# EAGLE design EpyxFastLoad (EAGLE 9.5.2)
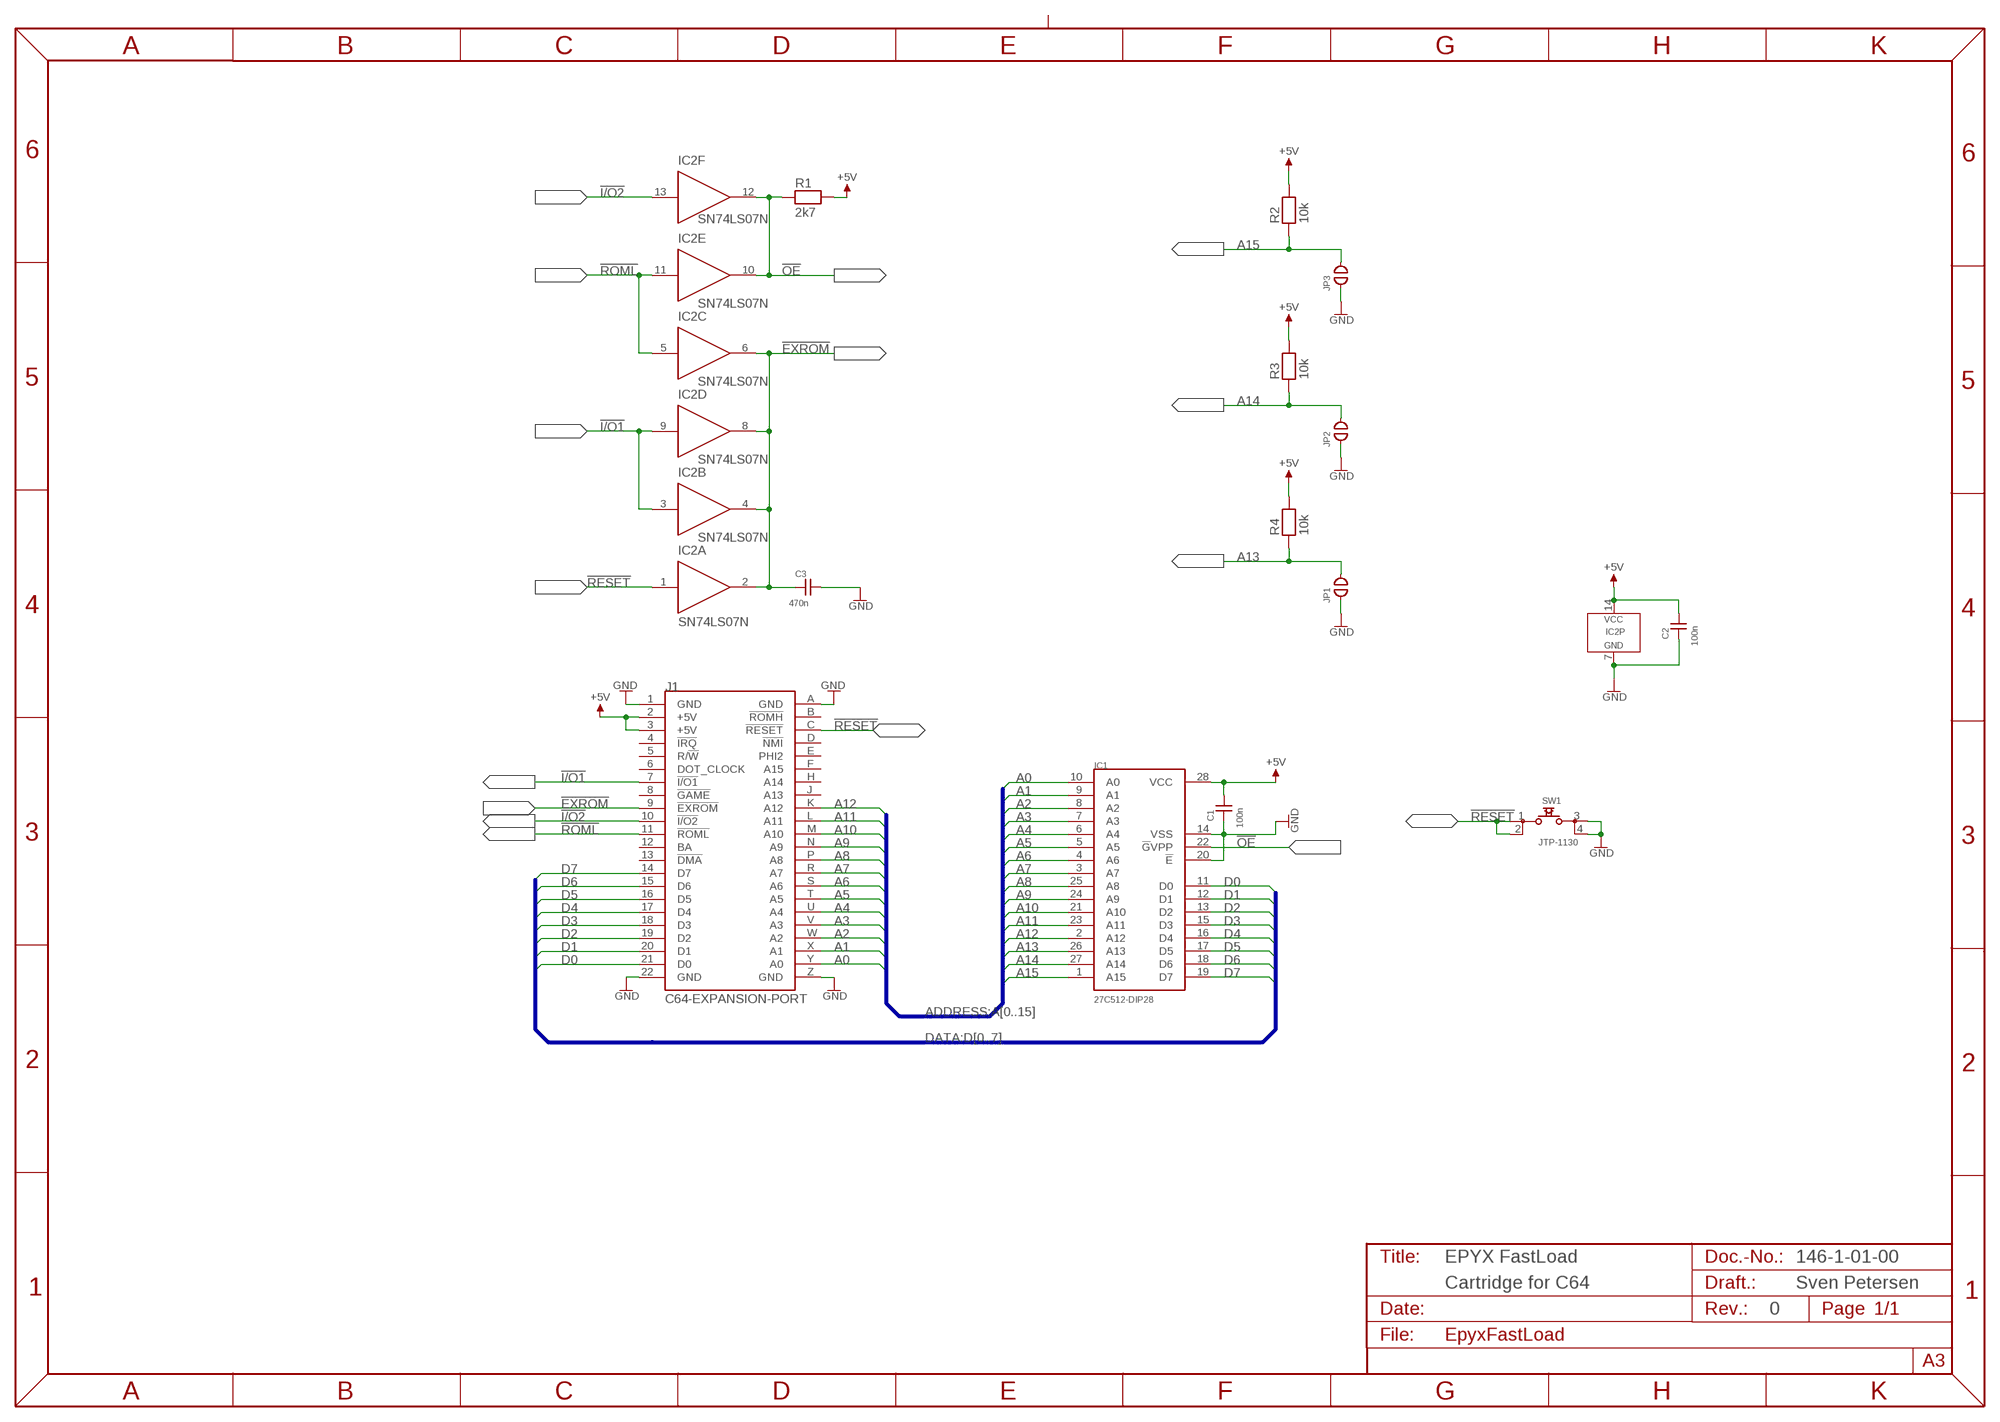
[diagram p0: schematic, sheet 1]

## Parts
C1  100n  CAP01  [C-2,5]
C2  100n  CAP01  [C-2,5]
C3  470n  CAP02  [C-5]
IC1  27C512-DIP28  M27C512-DIP28  [DIL28-6]
IC2  SN74LS07N  7407N  [DIL-14]
J1  C64-EXPANSION-PORT  C64-EXPANSIONPNARROW  [EXPANSIO_SQ]
JP1  OPEN  [CP_OP]
JP2  OPEN  [CP_OP]
JP3  OPEN  [CP_OP]
R1  2k7  RES04  [R-10]
R2  10k  RES04  [R-10]
R3  10k  RES04  [R-10]
R4  10k  RES04  [R-10]
SW1  JTP-1130  [JTP-1130]

## Nets
!EXROM: C3.1 IC2.2(A:O) IC2.4(B:O) IC2.6(C:O) IC2.8(D:O) J1.9(!EXROM)
!I/O1: IC2.3(B:I) IC2.9(D:I) J1.7(!I/O1)
!I/O2: IC2.13(F:I) J1.10(!I/O2)
!OE: IC1.22(!G!VPP) IC2.10(E:O) IC2.12(F:O) R1.1
!RESET: IC2.1(A:I) J1.C(!RESET) SW1.1 SW1.2
!ROML: IC2.5(C:I) IC2.11(E:I) J1.11(!ROML)
+5V: C1.2 C2.2 IC1.28(VCC) IC2.14(P:VCC) J1.2(+5V) J1.3(+5V) R1.2 R2.2 R3.2 R4.2
A0: IC1.10(A0) J1.Y(A0)
A1: IC1.9(A1) J1.X(A1)
A2: IC1.8(A2) J1.W(A2)
A3: IC1.7(A3) J1.V(A3)
A4: IC1.6(A4) J1.U(A4)
A5: IC1.5(A5) J1.T(A5)
A6: IC1.4(A6) J1.S(A6)
A7: IC1.3(A7) J1.R(A7)
A8: IC1.25(A8) J1.P(A8)
A9: IC1.24(A9) J1.N(A9)
A10: IC1.21(A10) J1.M(A10)
A11: IC1.23(A11) J1.L(A11)
A12: IC1.2(A12) J1.K(A12)
A13: IC1.26(A13) JP1.2 R4.1
A14: IC1.27(A14) JP2.2 R3.1
A15: IC1.1(A15) JP3.2 R2.1
D0: IC1.11(D0) J1.21(D0)
D1: IC1.12(D1) J1.20(D1)
D2: IC1.13(D2) J1.19(D2)
D3: IC1.15(D3) J1.18(D3)
D4: IC1.16(D4) J1.17(D4)
D5: IC1.17(D5) J1.16(D5)
D6: IC1.18(D6) J1.15(D6)
D7: IC1.19(D7) J1.14(D7)
GND: C1.1 C2.1 C3.2 IC1.14(VSS) IC1.20(!E) IC2.7(P:GND) J1.1(GND) J1.22(GND) J1.A(GND) J1.Z(GND) JP1.1 JP2.1 JP3.1 SW1.3 SW1.4
Unconnected: J1.4(!IRQ) J1.5(R/!W) J1.6(DOT_CLOCK) J1.8(!GAME) J1.12(BA) J1.13(!DMA) J1.B(!ROMH) J1.D(!NMI) J1.E(PHI2) J1.F(A15) J1.H(A14) J1.J(A13)

## Buses
DATA:D[0..7]
ADDRESS:A[0..15]

## Notes on the sheet
- EPYX FastLoad | 146-1-01-00
- Cartridge for C64 | Sven Petersen
- 0

## Library data of the parts
C1 C2 = DISCRETE:CAP01
C3 = DISCRETE:CAP02
IC1 = ST:M27C512
IC2 = 74XX:7407
J1 = Commodore:C64-EXPANSIONP
JP1-JP3 = Cutpad:OPEN: open Cutpad
R1-R4 = DISCRETE:RES04
SW1 = Namae_Electronics:JTP-1130

## Board
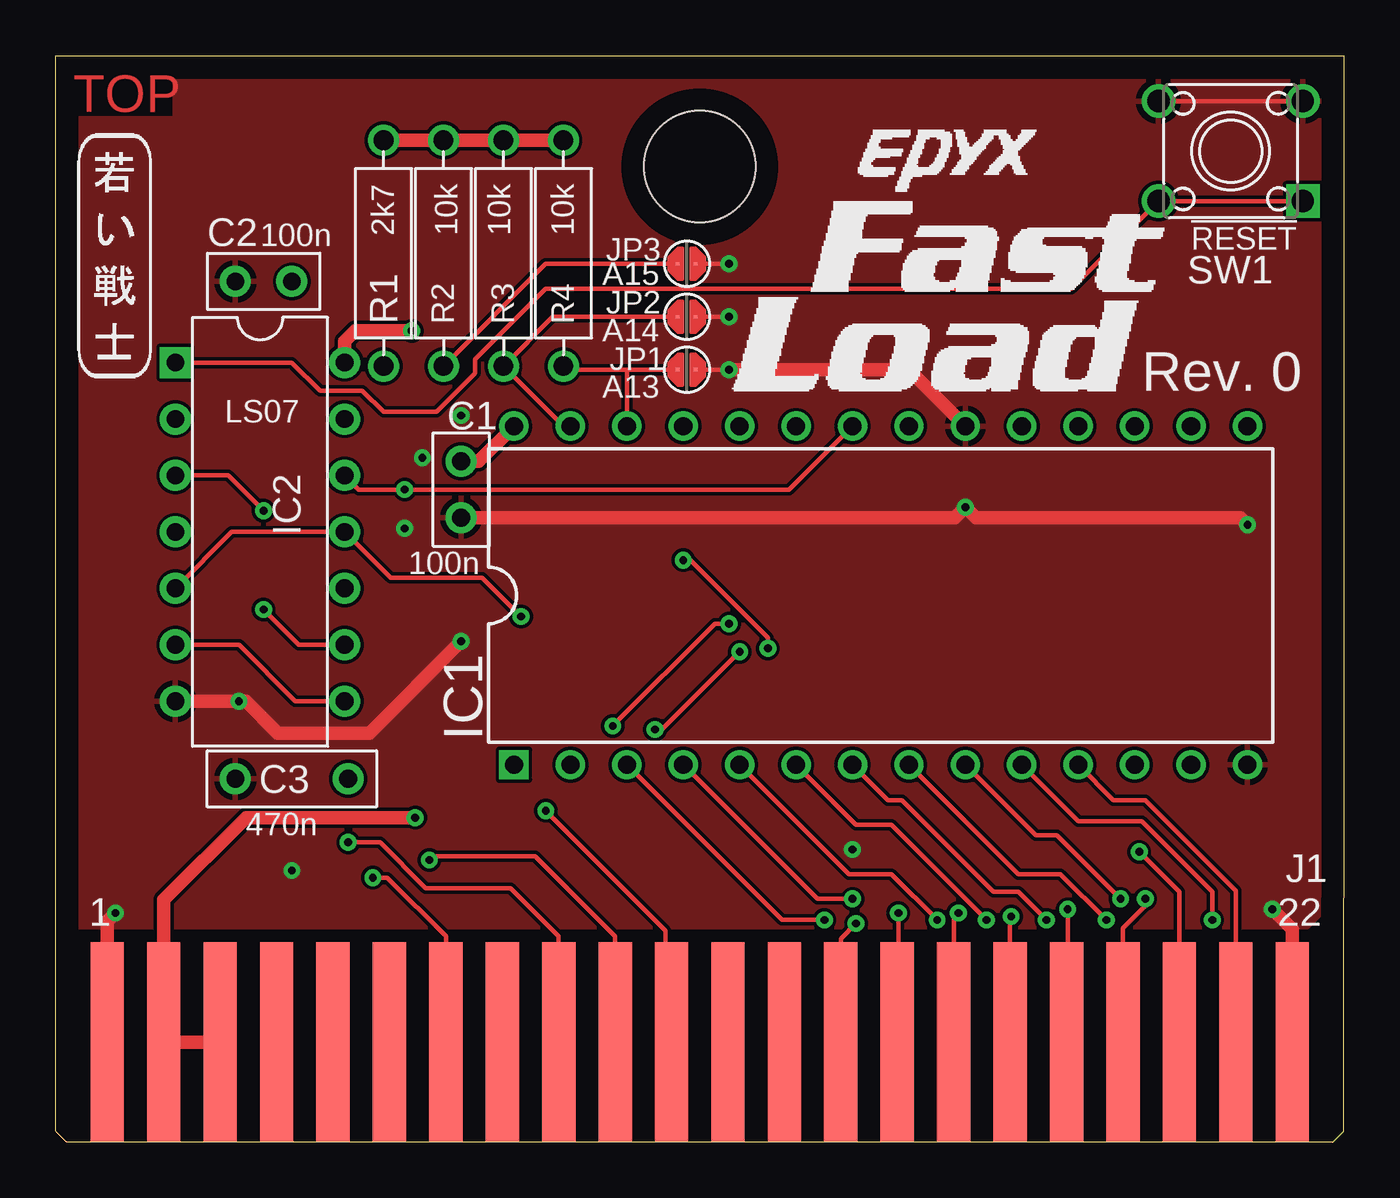
[diagram p1: board, top side]
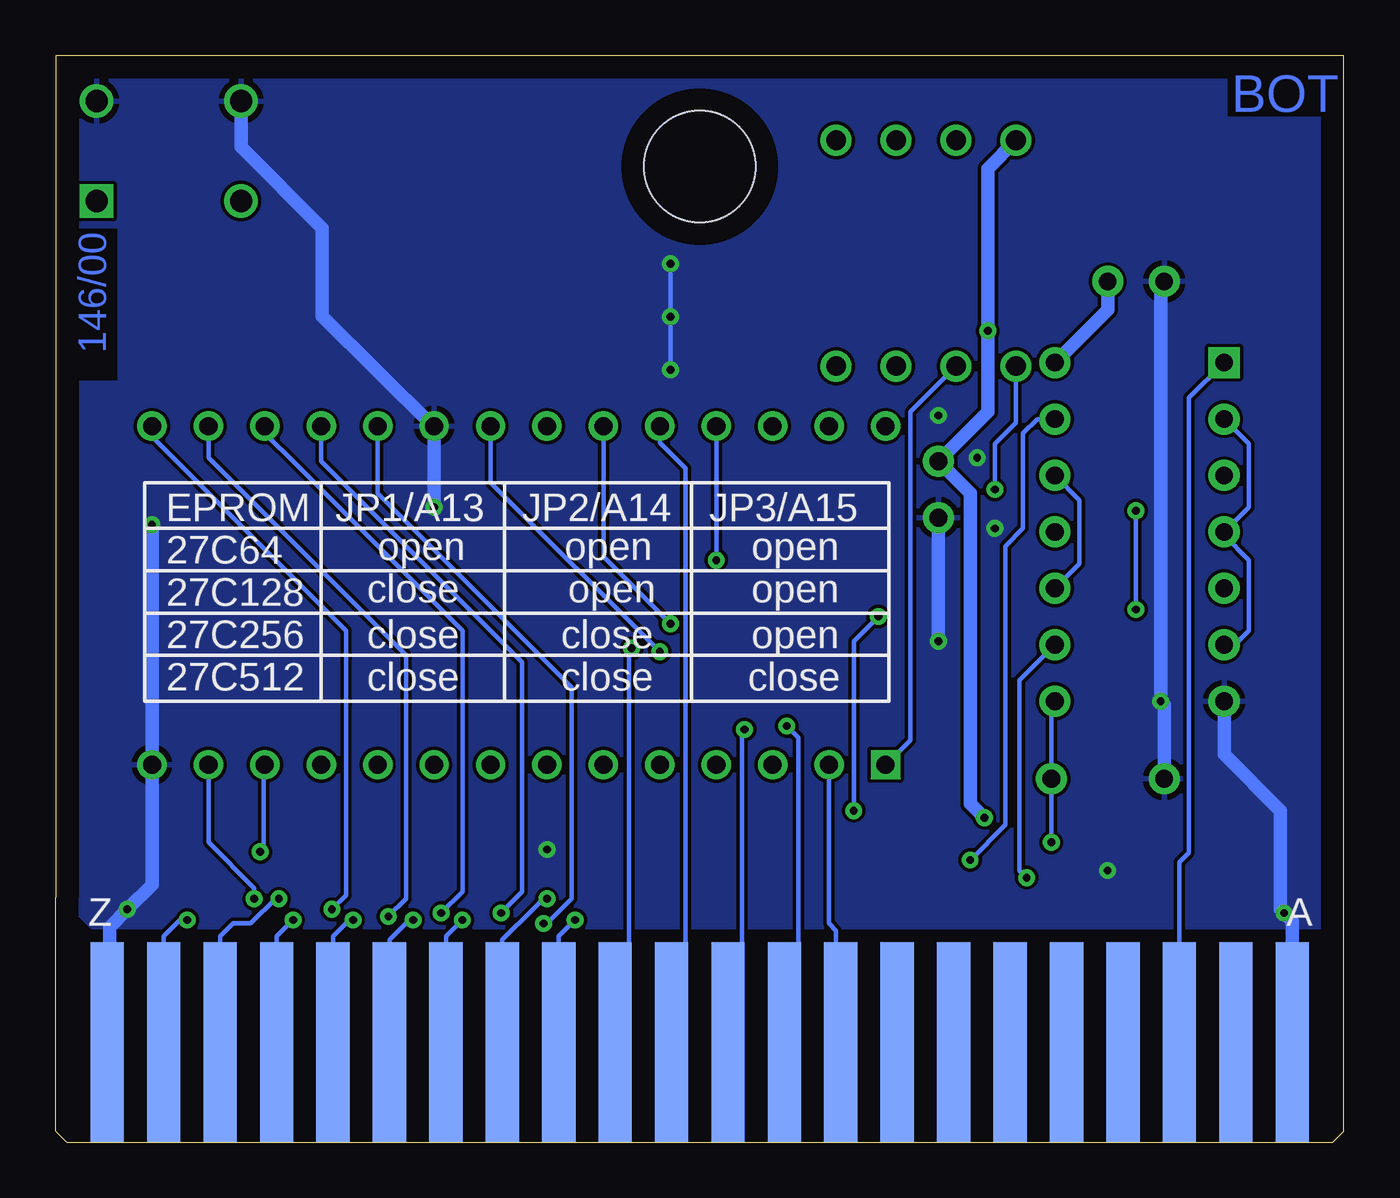
[diagram p2: board, bottom side, seen from below]

Size 58 x 48.9 mm. Coordinates in mm from the lower left corner, seen from the top.
Outline: 0,11 0,48.9 58,48.9 58,11
Copper layers (1*16): Top 0.035mm / dielectric 1.5mm / Bottom 0.035mm
Design rules "default *": minimum track width 6mil, minimum drill 0.35mm, track to track 6mil, track to pad 6mil, pad to pad 6mil, via to via 6mil, smd to smd 6mil, copper to edge 40mil, drill to drill 6mil, minimum pad ring 10mil, minimum via ring 8mil, stop-mask expansion 4mil, vias tented up to drill 24mil, thermal gap 10mil
Holes 5 mm at 29,43.9
bRestrict: 3 lines

### Footprints (pad centres in the part's own frame; a part is rotated, then mirrored left to right if it is on the bottom)
C-2,5 = drill 0.8 pad 1.397: 1 -1.27,0; 2 1.27,0
C-5 = drill 0.8 pad 1.397: 1 -2.54,0; 2 2.54,0
DIL28-6 = drill 0.813 square: 1 -16.51,-7.62 | drill 0.813: 2 -13.97,-7.62; 3 -11.43,-7.62; 4 -8.89,-7.62; 5 -6.35,-7.62; 6 -3.81,-7.62; 7 -1.27,-7.62; 8 1.27,-7.62; 9 3.81,-7.62; 10 6.35,-7.62; 11 8.89,-7.62; 12 11.43,-7.62; 13 13.97,-7.62; 14 16.51,-7.62; 15 16.51,7.62; 16 13.97,7.62; 17 11.43,7.62; 18 8.89,7.62; 19 6.35,7.62; 20 3.81,7.62; 21 1.27,7.62; 22 -1.27,7.62; 23 -3.81,7.62; 24 -6.35,7.62; 25 -8.89,7.62; 26 -11.43,7.62; 27 -13.97,7.62; 28 -16.51,7.62
DIL-14 = drill 0.8 pad 1.397 square: 1 -7.62,-3.81 | drill 0.8 pad 1.397: 2 -5.08,-3.81; 3 -2.54,-3.81; 4 0,-3.81; 5 2.54,-3.81; 6 5.08,-3.81; 7 7.62,-3.81; 8 7.62,3.81; 9 5.08,3.81; 10 2.54,3.81; 11 0,3.81; 12 -2.54,3.81; 13 -5.08,3.81; 14 -7.62,3.81
EXPANSIO_SQ = smd 1.5 x 9: 1 26.67,-4.5; 2 24.13,-4.5; 3 21.59,-4.5; 4 19.05,-4.5; 5 16.51,-4.5; 6 13.97,-4.5; 7 11.43,-4.5; 8 8.89,-4.5; 9 6.35,-4.5; 10 3.81,-4.5; 11 1.27,-4.5; 12 -1.27,-4.5; 13 -3.81,-4.5; 14 -6.35,-4.5; 15 -8.89,-4.5; 16 -11.43,-4.5; 17 -13.97,-4.5; 18 -16.51,-4.5; 19 -19.05,-4.5; 20 -21.59,-4.5; 21 -24.13,-4.5; 22 -26.67,-4.5 | smd 1.5 x 9 bottom: A 26.67,-4.5; B 24.13,-4.5; C 21.59,-4.5; D 19.05,-4.5; E 16.51,-4.5; F 13.97,-4.5; H 11.43,-4.5; J 8.89,-4.5; K 6.35,-4.5; L 3.81,-4.5; M 1.27,-4.5; N -1.27,-4.5; P -3.81,-4.5; R -6.35,-4.5; S -8.89,-4.5; T -11.43,-4.5; U -13.97,-4.5; V -16.51,-4.5; W -19.05,-4.5; X -21.59,-4.5; Y -24.13,-4.5; Z -26.67,-4.5
CP_OP = smd 0.152 x 0.152: 1 -0.4,0; 2 0.4,0
R-10 = drill 0.889 pad 1.397: 1 -5.08,0; 2 5.08,0
JTP-1130 = drill 1 square: 1 3.25,-2.25 | drill 1: 2 -3.25,-2.25; 3 3.25,2.25; 4 -3.25,2.25

### Placement (x,y rotation side)
C1  18.26,29.37 90 top
C2  9.37,38.73 0 top
C3  10.64,16.35 180 top
IC1  37.15,24.61 0 top
IC2  9.21,27.46 270 top
J1  29,0 180 top
JP1  28.42,34.77 180 top
JP2  28.42,37.15 180 top
JP3  28.42,39.53 180 top
R1  14.76,40.01 90 top
R2  17.46,40.01 90 top
R3  20.16,40.01 90 top
R4  22.86,40.01 90 top
SW1  52.9,44.6 0 top
U$11  [EPYXFL]  30.32,33.5 0 top
U$40  [2LAYER]  0.79,46.35 0 top
U$41  [PCB-TITLE/]  0,60.96 0 top  (outside the outline)
U$42  [SVEN_TAG]  2.7,40.01 0 top

### Tracks (layer width: path | path; a pad name or v marks a point on that pad's centre or on a via)
!EXROM  (via drill 0.35)
  Top 0.203: J1.9 22.65,9.26 20.48,11.43 16.67,11.43 14.61,13.49 v13.18,13.49 | IC2.6 8.26,22.38 10.79,19.84 IC2.8
  Bottom 0.203: IC2.2 4.29,31.43 4.29,28.57 IC2.4 5.4,27.3 4.29,26.19 4.29,23.02 4.92,22.38 IC2.6 | v13.18,13.49 C3.1 13.18,19.68 IC2.8
!I/O1  (via drill 0.35)
  Top 0.203: J1.7 17.57,9.26 14.92,11.91 v14.29,11.91 | IC2.9 10.95,22.38 v9.37,23.97 | v9.37,28.42 7.78,30 IC2.3
  Bottom 0.203: v14.29,11.91 14.61,12.22 14.61,20.8 IC2.9 | v9.37,23.97 v9.37,28.42
!I/O2  (via drill 0.35)
  Top 0.203: J1.10 25.19,9.26 21.59,12.86 16.99,12.86 v16.83,12.7
  Bottom 0.203: IC2.13 13.81,32.54 14.45,31.91 14.45,27.62 15.24,26.83 15.24,14.29 v16.83,12.7
!OE  (via drill 0.35)
  Top 0.203: IC2.12 13.65,29.37 v15.72,29.37 33.02,29.37 IC1.22
  Bottom 0.203: IC2.10 11.91,26.04 11.91,28.89 IC2.12 | R1.1 14.76,32.38 15.72,31.43 v15.72,29.37
!RESET
  Top 0.203: SW1.1 SW1.2 45.72,38.42 22.07,38.42 18.89,35.24 18.89,34.61 17.14,32.86 14.76,32.86 13.81,33.81 11.91,33.81 10.64,35.08 IC2.1
  Bottom 0.203: IC2.1 6.99,33.5 6.99,17.3 6.99,13.02 7.41,12.59 J1.C
!ROML  (via drill 0.35)
  Top 0.203: J1.11 27.46,4.77 27.46,9.53 v22.07,14.92 | IC2.5 7.94,27.46 IC2.11 15.08,25.4 19.21,25.4 20.08,24.53 v20.95,23.65
  Bottom 0.203: v20.95,23.65 22.07,22.54 v22.07,14.92
+5V  (via drill 0.35)
  Top 0.61: IC1.28 19.05,30.64 18.41,30.64 C1.2 | R4.2 R3.2 R2.2 R1.2 | J1.3 J1.2 4.87,10.9 8.57,14.61 v16.19,14.61 | IC2.14 13.02,36.04 13.49,36.51 v16.03,36.51
  Bottom 0.61: IC2.14 10.64,37.47 C2.2 | v16.19,14.61 16.83,15.24 16.83,29.21 C1.2 16.03,32.86 v16.03,36.51 16.03,43.81 R1.2
A0  (via drill 0.35)
  Top 0.203: IC1.10 46.04,14.45 48.9,14.45 52.07,11.27 v52.07,10
  Bottom 0.203: v52.07,10 52.39,10 53.13,9.26 J1.Y
A1  (via drill 0.35)
  Top 0.203: v47.94,10.95 45.09,13.81 44.13,13.81 IC1.9
  Bottom 0.203: J1.X 50.59,9.26 50.01,9.84 49.21,9.84 48.1,10.95 v47.94,10.95
A2  (via drill 0.35)
  Top 0.203: v47.31,10 45.24,12.06 43.34,12.06 IC1.8
  Bottom 0.203: J1.W 48.05,9.26 v47.31,10
A3  (via drill 0.35)
  Top 0.203: IC1.7 37.47,15.4 38.1,15.4 42.23,11.27 43.34,11.27 v44.61,10
  Bottom 0.203: J1.V 45.51,9.26 44.77,10 v44.61,10
A4  (via drill 0.35)
  Top 0.203: v41.91,10 37.62,14.29 36.04,14.29 IC1.6
  Bottom 0.203: J1.U 42.97,9.1 42.07,10 v41.91,10
A5  (via drill 0.35)
  Top 0.203: v39.69,10 37.62,12.06 35.72,12.06 IC1.5
  Bottom 0.203: J1.T 40.43,9.26 v39.69,10
A6  (via drill 0.35)
  Top 0.203: v35.88,10.95 34.29,10.95 IC1.4
  Bottom 0.203: J1.S 37.89,9.1 36.51,10.48 36.04,10.95 v35.88,10.95
A7  (via drill 0.35)
  Top 0.203: v34.61,10 32.7,10 IC1.3
  Bottom 0.203: J1.R 35.35,9.26 v34.61,10
A8  (via drill 0.35)
  Top 0.203: v32.07,22.23 32.07,22.7 28.57,26.19 v28.26,26.19
  Bottom 0.203: v32.07,22.23 32.17,22.12 32.17,5.13 J1.P | IC1.25 v28.26,26.19
A9
  Bottom 0.203: J1.N 29.64,5.13 29.64,30.32 30.8,31.48 IC1.24
A10  (via drill 0.35)
  Top 0.203: v30.8,22.07 27.3,18.57 v26.99,18.57
  Bottom 0.203: v26.99,18.57 27.09,18.47 27.09,5.13 J1.M | v30.8,22.07 38.42,29.69 IC1.21
A11  (via drill 0.35)
  Top 0.203: v30.32,23.34 29.69,23.34 v25.08,18.73
  Bottom 0.203: v25.08,18.73 24.55,18.2 24.55,5.13 J1.L | IC1.23 33.34,26.35 v30.32,23.34
A12
  Bottom 0.203: J1.K 22.86,4.71 22.86,9.53 23.18,9.84 IC1.2
A13
  Top 0.203: R4.1 23.02,34.77 25.72,34.77 | 25.72,34.77 JP1.2 | IC1.26 25.72,34.77
A14
  Top 0.203: JP2.2 26.75,37.15 22.38,37.15 R3.1 22.86,32.23 IC1.27
A15
  Top 0.203: R2.1 22.07,39.53 26.91,39.53 JP3.2
  Bottom 0.203: R2.1 19.53,32.86 19.53,18.1 IC1.1
D0
  Top 0.203: J1.21 53.13,11.32 49.05,15.4 47.62,15.4 IC1.11
D1  (via drill 0.35)
  Top 0.203: v48.79,13.07 50.59,11.26 J1.20
  Bottom 0.203: v48.79,13.07 48.63,13.23 48.63,16.94 IC1.12
D2  (via drill 0.35)
  Top 0.203: J1.19 48.05,9.63 49.05,10.64 v49.05,10.95
  Bottom 0.203: v49.05,10.95 49.05,11.43 51.12,13.49 IC1.13
D3  (via drill 0.35)
  Top 0.203: J1.18 45.56,4.55 v45.56,10.48
  Bottom 0.203: v45.56,10.48 44.93,11.11 44.93,11.43 44.93,23.02 52.39,30.48 53.66,31.75 IC1.15
D4  (via drill 0.35)
  Top 0.203: J1.17 42.97,9.95 43.02,10 v43.02,10.16
  Bottom 0.203: v43.02,10.16 42.23,10.95 42.23,21.91 51.12,30.8 IC1.16
D5  (via drill 0.35)
  Top 0.203: J1.16 40.43,10.11 v40.64,10.32
  Bottom 0.203: v40.64,10.32 39.69,11.27 39.69,23.02 47.15,30.48 48.58,31.91 IC1.17
D6  (via drill 0.35)
  Top 0.203: J1.15 37.94,4.55 37.94,9.84 v37.94,10.32
  Bottom 0.203: v37.94,10.32 36.99,11.27 36.99,21.59 46.04,30.64 IC1.18
D7  (via drill 0.35)
  Top 0.203: J1.14 35.35,9.16 v36.04,9.84
  Bottom 0.203: v36.04,9.84 35.88,9.84 34.77,10.95 34.77,20.48 43.5,29.21 IC1.19
GND  (via drill 0.35)
  Top 0.203: SW1.3 SW1.4 | JP1.1 v30.32,34.77 | v30.32,37.15 JP2.1 | v30.32,39.53 JP3.1
  Top 0.61: J1.A 2.33,9.95 v2.7,10.32 | v54.77,10.48 55.67,9.58 J1.22 | C1.1 40.48,28.1 v40.96,28.57 41.43,28.1 53.34,28.1 v53.66,27.78 | v30.32,34.77 38.42,34.77 IC1.20 | IC2.7 v8.26,19.84 8.57,19.84 10,18.41 14.13,18.41 v18.26,22.54
  Bottom 0.203: v30.32,34.77 v30.32,37.15 v30.32,39.53
  Bottom 0.61: J1.A 2.33,9.95 v2.7,10.32 2.86,10.48 2.86,14.92 5.4,17.46 IC2.7 | J1.22 55.56,4.61 55.56,9.68 v54.77,10.48 53.66,11.59 IC1.14 v53.66,27.78 | v40.96,28.57 IC1.20 41.01,32.23 46,37.18 46,41.13 49.65,44.79 SW1.4 | C2.1 8.26,38.58 v8.26,19.84 8.1,19.68 C3.2 | v18.26,22.54 C1.1
  other vias: 15.72,27.62 16.51,30.8 18.26,32.7 35.88,13.18 10.64,12.22
  pour Top: 0.64,48.26 0.64,10 0.95,9.68 56.36,9.68 57.15,10.48 57.15,48.26
  pour Bottom: 0.64,48.26 0.64,10 0.95,9.68 56.36,9.68 57.15,10.48 57.15,48.26

### Text on the board
Bottom: 146/00
tPlace: 2k7 | 10k | 10k | 10k | 100n | !RESET | A15 | A14 | Rev. 0 | A13 | LS07 | 100n | 470n
bPlace: JP3/A15 | JP2/A14 | JP1/A13 | EPROM | open | open | open | 27C64 | open | open | close | 27C128 | open | close | close | 27C256 | close | close | close | 27C512
Measures: 5.0
Document: Sven Petersen | 146-2-01-00 | 2020 | 35µm | 2 | 0